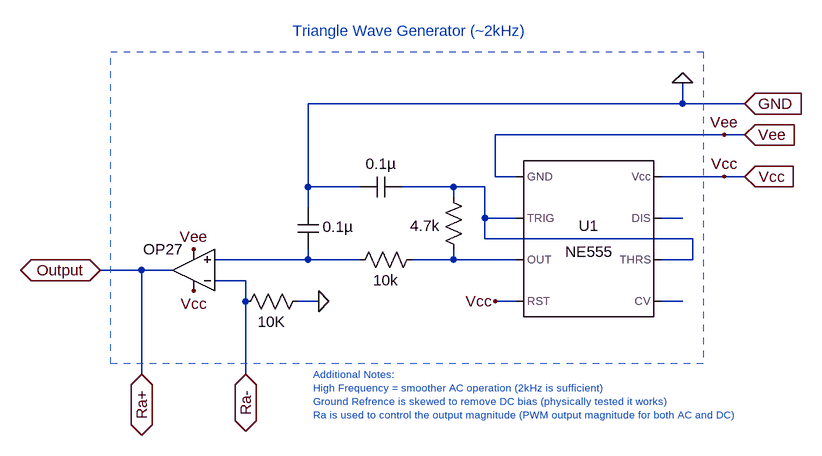
[diagram p0: schematic Triangle_Wave_Generator.asc]
Triangle_Wave_Generator.asc, the LTspice schematic file:
Version 4
SHEET 1 880 680
WIRE 192 -112 192 -144
WIRE 192 -112 -384 -112
WIRE 288 -112 192 -112
WIRE 256 -64 -96 -64
WIRE 288 -64 256 -64
WIRE -96 0 -96 -64
WIRE -64 0 -96 0
WIRE 256 0 160 0
WIRE 288 0 256 0
WIRE -384 16 -384 -112
WIRE -304 16 -384 16
WIRE -160 16 -240 16
WIRE -112 16 -160 16
WIRE -160 32 -160 16
WIRE -384 48 -384 16
WIRE -112 64 -112 16
WIRE -64 64 -112 64
WIRE 192 64 160 64
WIRE -112 96 -112 64
WIRE 208 96 -112 96
WIRE -384 128 -384 112
WIRE -384 128 -528 128
WIRE -304 128 -384 128
WIRE -160 128 -160 112
WIRE -160 128 -224 128
WIRE -64 128 -160 128
WIRE 208 128 208 96
WIRE 208 128 160 128
WIRE -640 144 -704 144
WIRE -592 144 -640 144
WIRE -480 160 -528 160
WIRE -480 192 -480 160
WIRE -368 192 -400 192
WIRE -64 192 -96 192
WIRE 192 192 160 192
WIRE -640 304 -640 144
WIRE -480 304 -480 192
FLAG 288 0 Vcc
IOPIN 288 0 In
FLAG -704 144 Output
IOPIN -704 144 BiDir
FLAG 288 -64 Vee
IOPIN 288 -64 In
FLAG 288 -112 GND
IOPIN 288 -112 In
FLAG 192 -144 0
FLAG 256 -64 Vee
FLAG 256 0 Vcc
FLAG -96 192 Vcc
FLAG -560 176 Vcc
FLAG -368 192 0
FLAG -560 112 Vee
FLAG -640 304 Ra+
IOPIN -640 304 BiDir
FLAG -480 304 Ra-
IOPIN -480 304 BiDir
SYMBOL Misc\\NE555 48 96 R0
SYMATTR InstName U1
SYMBOL res -208 112 R90
WINDOW 0 0 56 Invisible 2
WINDOW 3 32 56 VTop 2
SYMATTR InstName R3
SYMATTR Value 10k
SYMBOL cap -368 112 R180
WINDOW 0 24 56 Invisible 2
WINDOW 3 -54 35 Left 2
SYMATTR InstName C2
SYMATTR Value 0.1µ
SYMBOL res -144 128 R180
WINDOW 0 36 76 Invisible 2
WINDOW 3 37 52 Left 2
SYMATTR InstName R1
SYMATTR Value 4.7k
SYMBOL cap -304 32 R270
WINDOW 0 32 32 Invisible 2
WINDOW 3 67 32 VBottom 2
SYMATTR InstName C1
SYMATTR Value 0.1µ
SYMBOL Opamps\\OP27 -560 208 R180
WINDOW 0 16 32 Invisible 2
SYMATTR InstName U5
SYMBOL res -496 208 R270
WINDOW 0 32 56 Invisible 2
WINDOW 3 0 56 VBottom 2
SYMATTR InstName R10
SYMATTR Value 10K
TEXT -376 304 Left 1 ;Additional Notes:\nHigh Frequency = smoother AC operation (2kHz is sufficient)\nGround Refrence is skewed to remove DC bias (physically tested it works)\nRa is used to control the output magnitude (PWM output magnitude for both AC and DC)
TEXT -408 -224 Left 2 ;Triangle Wave Generator (~2kHz)
RECTANGLE Normal 224 288 -688 -192 2

The netlist it stands for:
* Triangle_Wave_Generator.asc
XU1 Vee N001 N004 Vcc N005 N001 N002 Vcc NE555  ; pins GND TRIG OUT RST CV THRS DIS Vcc
R3 N004 N003 10k
C2 N003 0 0.1µ
R1 N004 N001 4.7k
C1 0 N001 0.1µ
XU5 N003 Ra- Vcc Vee Ra+ OP27  ; pins In+ In- V+ V- OUT
R10 Ra- 0 10K
* Additional Notes:
* High Frequency = smoother AC operation (2kHz is sufficient)
* Ground Refrence is skewed to remove DC bias (physically tested it works)
* Ra is used to control the output magnitude (PWM output magnitude for both AC and DC)
* Triangle Wave Generator (~2kHz)
.lib NE555.sub
.lib ADI.lib
.backanno
.end